# EAGLE design Hall_Sensorv0.1 (EAGLE 8.4.3)
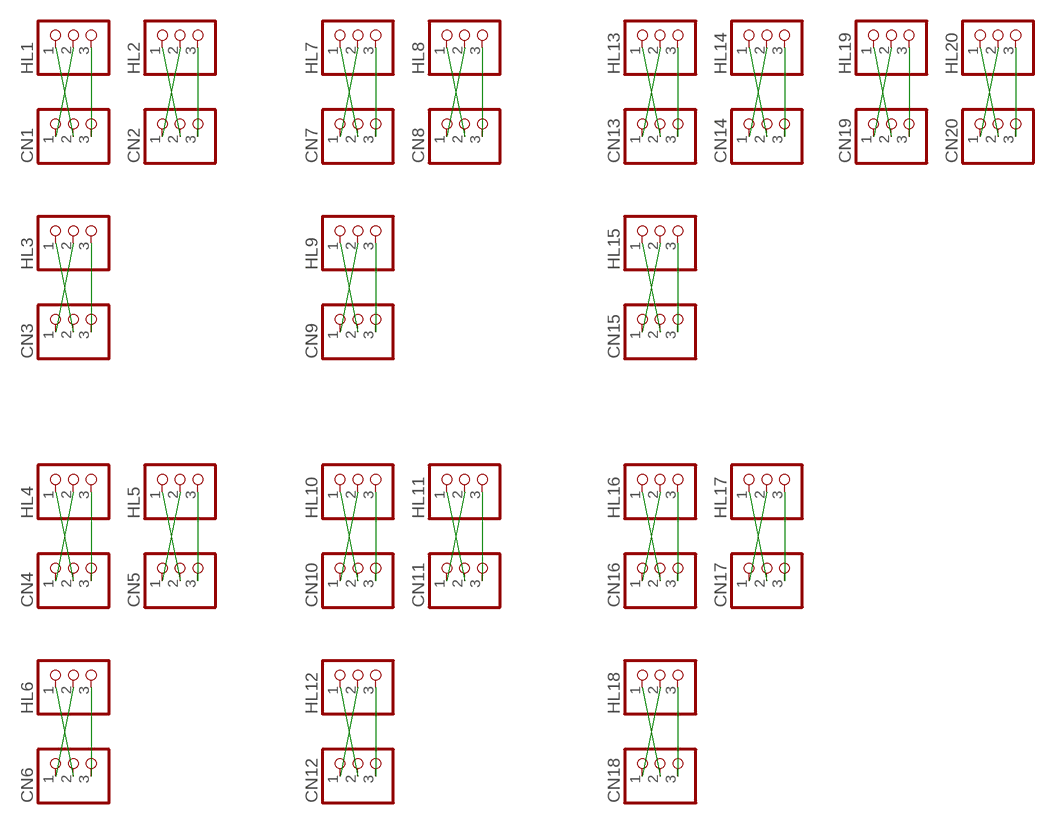
[diagram p0: schematic, sheet 1]

## Parts
CN1  PINHD-1X3  [1X03]
CN2  PINHD-1X3  [1X03]
CN3  PINHD-1X3  [1X03]
CN4  PINHD-1X3  [1X03]
CN5  PINHD-1X3  [1X03]
CN6  PINHD-1X3  [1X03]
CN7  PINHD-1X3  [1X03]
CN8  PINHD-1X3  [1X03]
CN9  PINHD-1X3  [1X03]
CN10  PINHD-1X3  [1X03]
CN11  PINHD-1X3  [1X03]
CN12  PINHD-1X3  [1X03]
CN13  PINHD-1X3  [1X03]
CN14  PINHD-1X3  [1X03]
CN15  PINHD-1X3  [1X03]
CN16  PINHD-1X3  [1X03]
CN17  PINHD-1X3  [1X03]
CN18  PINHD-1X3  [1X03]
CN19  PINHD-1X3  [1X03]
CN20  PINHD-1X3  [1X03]
HL1  PINHD-1X3  [1X03]
HL2  PINHD-1X3  [1X03]
HL3  PINHD-1X3  [1X03]
HL4  PINHD-1X3  [1X03]
HL5  PINHD-1X3  [1X03]
HL6  PINHD-1X3  [1X03]
HL7  PINHD-1X3  [1X03]
HL8  PINHD-1X3  [1X03]
HL9  PINHD-1X3  [1X03]
HL10  PINHD-1X3  [1X03]
HL11  PINHD-1X3  [1X03]
HL12  PINHD-1X3  [1X03]
HL13  PINHD-1X3  [1X03]
HL14  PINHD-1X3  [1X03]
HL15  PINHD-1X3  [1X03]
HL16  PINHD-1X3  [1X03]
HL17  PINHD-1X3  [1X03]
HL18  PINHD-1X3  [1X03]
HL19  PINHD-1X3  [1X03]
HL20  PINHD-1X3  [1X03]

## Nets
N$1: CN1.1 HL1.2
N$2: CN1.2 HL1.1
N$3: CN7.3 HL7.3
N$4: CN2.2 HL2.1
N$5: CN2.1 HL2.2
N$6: CN8.3 HL8.3
N$7: CN7.2 HL7.1
N$8: CN7.1 HL7.2
N$9: CN9.3 HL9.3
N$10: CN8.2 HL8.1
N$11: CN8.1 HL8.2
N$12: CN10.3 HL10.3
N$13: CN13.2 HL13.1
N$14: CN13.1 HL13.2
N$15: CN11.3 HL11.3
N$16: CN14.2 HL14.1
N$17: CN14.1 HL14.2
N$18: CN12.3 HL12.3
N$19: CN19.2 HL19.1
N$20: CN19.1 HL19.2
N$21: CN13.3 HL13.3
N$22: CN20.2 HL20.1
N$23: CN20.1 HL20.2
N$24: CN14.3 HL14.3
N$25: CN15.2 HL15.1
N$26: CN15.1 HL15.2
N$27: CN15.3 HL15.3
N$28: CN9.2 HL9.1
N$29: CN9.1 HL9.2
N$30: CN16.3 HL16.3
N$31: CN3.2 HL3.1
N$32: CN3.1 HL3.2
N$33: CN17.3 HL17.3
N$34: CN4.2 HL4.1
N$35: CN4.1 HL4.2
N$36: CN18.3 HL18.3
N$37: CN5.2 HL5.1
N$38: CN5.1 HL5.2
N$39: CN19.3 HL19.3
N$40: CN10.2 HL10.1
N$41: CN10.1 HL10.2
N$42: CN11.2 HL11.1
N$43: CN20.3 HL20.3
N$44: CN11.1 HL11.2
N$45: CN1.3 HL1.3
N$46: CN16.2 HL16.1
N$47: CN16.1 HL16.2
N$48: CN17.2 HL17.1
N$49: CN17.1 HL17.2
N$50: CN6.2 HL6.1
N$51: CN2.3 HL2.3
N$52: CN6.1 HL6.2
N$53: CN12.2 HL12.1
N$54: CN12.1 HL12.2
N$55: CN3.3 HL3.3
N$56: CN18.2 HL18.1
N$57: CN18.1 HL18.2
N$59: CN4.3 HL4.3
N$62: CN5.3 HL5.3
N$65: CN6.3 HL6.3

## Library data of the parts
CN1-CN20 HL1-HL20 = pinhead:PINHD-1X3: PIN HEADER

## Net classes
0 default: width 1.016 mm, clearance 0.254 mm

## Board
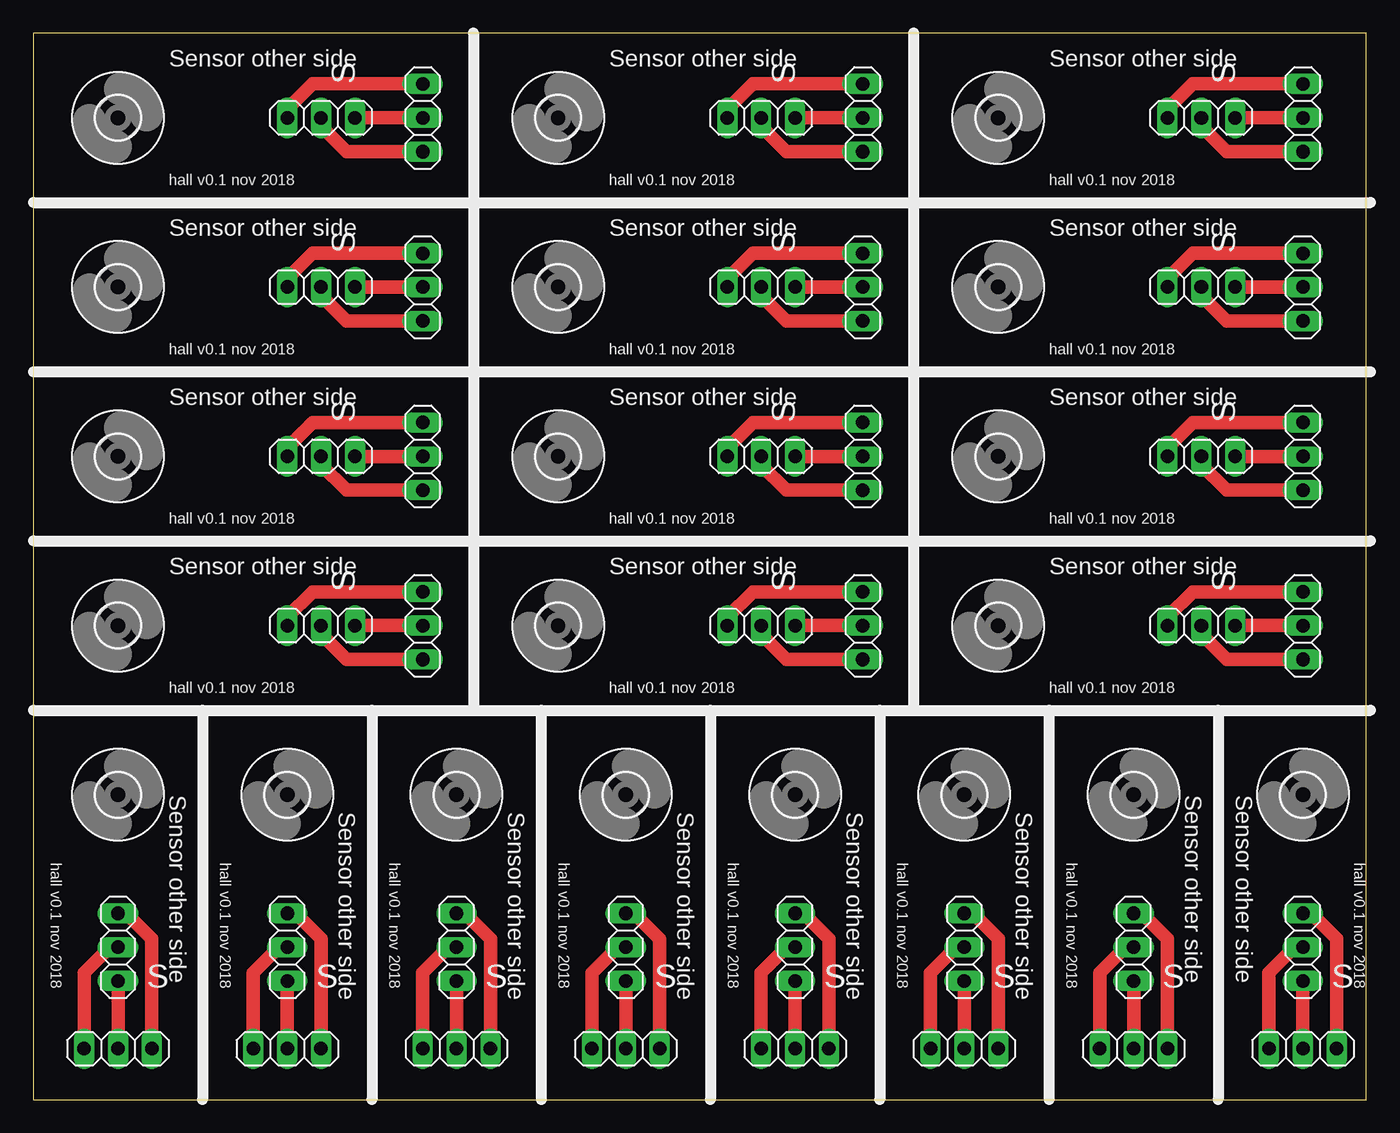
[diagram p1: board, top side]

Size 100 x 80 mm. Coordinates in mm from the lower left corner, seen from the top.
Outline: 0,0 100,0 100,80 0,80 0,0
Copper layers (1*16): Top 0.035mm / dielectric 1.5mm / Bottom 0.035mm
Design rules "default": minimum track width 6mil, minimum drill 0.35mm, track to track 6mil, track to pad 6mil, pad to pad 6mil, via to via 6mil, smd to smd 6mil, copper to edge 40mil, drill to drill 6mil, minimum pad ring 10mil, minimum via ring 8mil, stop-mask expansion 4mil, vias tented up to drill 0mil, thermal gap 10mil

### Footprints (pad centres in the part's own frame; a part is rotated, then mirrored left to right if it is on the bottom)
1X03 = drill 1.016 long: 1 -2.54,0; 2 0,0; 3 2.54,0
3,2 = hole 3.2: 0,0

### Placement (x,y rotation side)
CN1  29.21,73.66 90 top
CN2  62.23,73.66 90 top
CN3  95.25,73.66 90 top
CN4  29.21,60.96 90 top
CN5  62.23,60.96 90 top
CN6  95.25,60.96 90 top
CN7  29.21,48.26 90 top
CN8  62.23,48.26 90 top
CN9  95.25,48.26 90 top
CN10  29.21,35.56 90 top
CN11  62.23,35.56 90 top
CN12  95.25,35.56 90 top
CN13  6.35,3.81 0 top
CN14  19.05,3.81 0 top
CN15  31.75,3.81 0 top
CN16  44.45,3.81 0 top
CN17  57.15,3.81 0 top
CN18  69.85,3.81 0 top
CN19  82.55,3.81 0 top
CN20  95.25,3.81 0 top
HL1  21.59,73.66 180 top
HL2  54.61,73.66 180 top
HL3  87.63,73.66 180 top
HL4  21.59,60.96 180 top
HL5  54.61,60.96 180 top
HL6  87.63,60.96 180 top
HL7  21.59,48.26 180 top
HL8  54.61,48.26 180 top
HL9  87.63,48.26 180 top
HL10  21.59,35.56 180 top
HL11  54.61,35.56 180 top
HL12  87.63,35.56 180 top
HL13  6.35,11.43 90 top
HL14  19.05,11.43 90 top
HL15  31.75,11.43 90 top
HL16  44.45,11.43 90 top
HL17  57.15,11.43 90 top
HL18  69.85,11.43 90 top
HL19  82.55,11.43 90 top
HL20  95.25,11.43 90 top
U$1  [3,2]  6.35,73.66 0 top
U$2  [3,2]  39.37,73.66 0 top
U$3  [3,2]  72.39,73.66 0 top
U$4  [3,2]  72.39,60.96 0 top
U$5  [3,2]  39.37,60.96 0 top
U$6  [3,2]  6.35,60.96 0 top
U$7  [3,2]  6.35,48.26 0 top
U$8  [3,2]  6.35,35.56 0 top
U$9  [3,2]  39.37,35.56 0 top
U$10  [3,2]  39.37,48.26 0 top
U$11  [3,2]  72.39,48.26 0 top
U$12  [3,2]  72.39,35.56 0 top
U$13  [3,2]  6.35,22.86 0 top
U$14  [3,2]  19.05,22.86 0 top
U$15  [3,2]  31.75,22.86 0 top
U$16  [3,2]  44.45,22.86 0 top
U$17  [3,2]  57.15,22.86 0 top
U$18  [3,2]  69.85,22.86 0 top
U$19  [3,2]  82.55,22.86 0 top
U$20  [3,2]  95.25,22.86 0 top

### Tracks (layer width: path | path; a pad name or v marks a point on that pad's centre or on a via)
N$1
  Top 1.016: CN1.1 23.5,71.12 21.59,73.03 HL1.2
N$2
  Top 1.016: CN1.2 HL1.1
N$3
  Top 1.016: HL7.3 19.05,48.9 20.95,50.8 CN7.3
N$4
  Top 1.016: CN2.2 HL2.1
N$5
  Top 1.016: CN2.1 56.52,71.12 54.61,73.03 HL2.2
N$6
  Top 1.016: HL8.3 52.07,48.9 53.98,50.8 CN8.3
N$7
  Top 1.016: CN7.2 HL7.1
N$8
  Top 1.016: CN7.1 23.5,45.72 21.59,47.62 HL7.2
N$9
  Top 1.016: HL9.3 85.09,48.9 87,50.8 CN9.3
N$10
  Top 1.016: CN8.2 HL8.1
N$11
  Top 1.016: CN8.1 56.52,45.72 54.61,47.62 HL8.2
N$12
  Top 1.016: HL10.3 19.05,36.2 20.95,38.1 CN10.3
N$13
  Top 1.016: HL13.1 CN13.2
N$14
  Top 1.016: CN13.1 3.81,9.53 5.71,11.43 HL13.2
N$15
  Top 1.016: HL11.3 52.07,36.2 53.98,38.1 CN11.3
N$16
  Top 1.016: HL14.1 CN14.2
N$17
  Top 1.016: CN14.1 16.51,9.53 18.41,11.43 HL14.2
N$18
  Top 1.016: HL12.3 85.09,36.2 87,38.1 CN12.3
N$19
  Top 1.016: HL19.1 CN19.2
N$20
  Top 1.016: CN19.1 80.01,9.53 81.92,11.43 HL19.2
N$21
  Top 1.016: HL13.3 6.99,13.97 8.89,12.06 CN13.3
N$22
  Top 1.016: HL20.1 CN20.2
N$23
  Top 1.016: CN20.1 92.71,9.53 94.61,11.43 HL20.2
N$24
  Top 1.016: HL14.3 19.68,13.97 21.59,12.06 CN14.3
N$25
  Top 1.016: HL15.1 CN15.2
N$26
  Top 1.016: CN15.1 29.21,9.53 31.11,11.43 HL15.2
N$27
  Top 1.016: HL15.3 32.38,13.97 34.29,12.06 CN15.3
N$28
  Top 1.016: CN9.2 HL9.1
N$29
  Top 1.016: CN9.1 89.53,45.72 87.63,47.62 HL9.2
N$30
  Top 1.016: HL16.3 45.09,13.97 46.99,12.06 CN16.3
N$31
  Top 1.016: CN3.2 HL3.1
N$32
  Top 1.016: CN3.1 89.53,71.12 87.63,73.03 HL3.2
N$33
  Top 1.016: HL17.3 57.78,13.97 59.69,12.06 CN17.3
N$34
  Top 1.016: CN4.2 HL4.1
N$35
  Top 1.016: CN4.1 23.5,58.42 21.59,60.33 HL4.2
N$36
  Top 1.016: HL18.3 70.48,13.97 72.39,12.06 CN18.3
N$37
  Top 1.016: CN5.2 HL5.1
N$38
  Top 1.016: CN5.1 56.52,58.42 54.61,60.33 HL5.2
N$39
  Top 1.016: HL19.3 83.19,13.97 85.09,12.06 CN19.3
N$40
  Top 1.016: CN10.2 HL10.1
N$41
  Top 1.016: CN10.1 23.5,33.02 21.59,34.92 HL10.2
N$42
  Top 1.016: CN11.2 HL11.1
N$43
  Top 1.016: HL20.3 95.89,13.97 97.79,12.06 CN20.3
N$44
  Top 1.016: CN11.1 56.52,33.02 54.61,34.92 HL11.2
N$45
  Top 1.016: HL1.3 19.05,74.3 20.95,76.2 CN1.3
N$46
  Top 1.016: HL16.1 CN16.2
N$47
  Top 1.016: CN16.1 41.91,9.53 43.81,11.43 HL16.2
N$48
  Top 1.016: HL17.1 CN17.2
N$49
  Top 1.016: CN17.1 54.61,9.53 56.52,11.43 HL17.2
N$50
  Top 1.016: CN6.2 HL6.1
N$51
  Top 1.016: HL2.3 52.07,74.3 53.98,76.2 CN2.3
N$52
  Top 1.016: CN6.1 89.53,58.42 87.63,60.33 HL6.2
N$53
  Top 1.016: CN12.2 HL12.1
N$54
  Top 1.016: CN12.1 89.53,33.02 87.63,34.92 HL12.2
N$55
  Top 1.016: HL3.3 85.09,74.3 87,76.2 CN3.3
N$56
  Top 1.016: HL18.1 CN18.2
N$57
  Top 1.016: CN18.1 67.31,9.53 69.22,11.43 HL18.2
N$59
  Top 1.016: HL4.3 19.05,61.59 20.95,63.5 CN4.3
N$62
  Top 1.016: HL5.3 52.07,61.59 53.98,63.5 CN5.3
N$65
  Top 1.016: HL6.3 85.09,61.59 87,63.5 CN6.3

### Text on the board
tNames: Sensor other side | Sensor other side | Sensor other side | S | S | S | hall v0.1 nov 2018 | hall v0.1 nov 2018 | hall v0.1 nov 2018 | Sensor other side | Sensor other side | Sensor other side | S | S | S | hall v0.1 nov 2018 | hall v0.1 nov 2018 | hall v0.1 nov 2018 | Sensor other side | Sensor other side | Sensor other side | S | S | S | hall v0.1 nov 2018 | hall v0.1 nov 2018 | hall v0.1 nov 2018 | Sensor other side | Sensor other side | Sensor other side | S | S | S | hall v0.1 nov 2018 | hall v0.1 nov 2018 | hall v0.1 nov 2018 | Sensor other side | Sensor other side | Sensor other side | Sensor other side | Sensor other side | Sensor other side | Sensor other side | Sensor other side | hall v0.1 nov 2018 | hall v0.1 nov 2018 | hall v0.1 nov 2018 | hall v0.1 nov 2018 | hall v0.1 nov 2018 | hall v0.1 nov 2018 | hall v0.1 nov 2018 | hall v0.1 nov 2018 | S | S | S | S | S | S | S | S
bNames: S | S | S | S | S | S | S | S | S | S | S | S | S | S | S | S | S | S | S | S